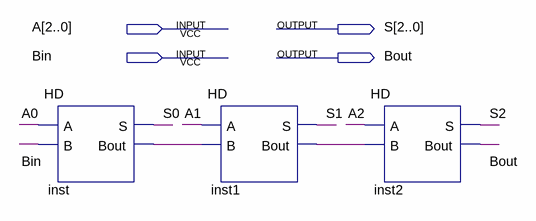
[diagram p0: schematic sheet]
// Quartus schematic DEC3.bdf as structural Verilog: 3 symbols, 4 pins
module DEC3 (
  input  [2:0] A,
  input  Bin,
  output [2:0] S,
  output Bout
);

  wire inst1_bout, inst_bout;

  HD inst (.A(A[0]), .B(Bin), .S(S[0]), .Bout(inst_bout));
  HD inst1 (.A(A[1]), .B(inst_bout), .S(S[1]), .Bout(inst1_bout));
  HD inst2 (.A(A[2]), .B(inst1_bout), .S(S[2]), .Bout(Bout));
endmodule
